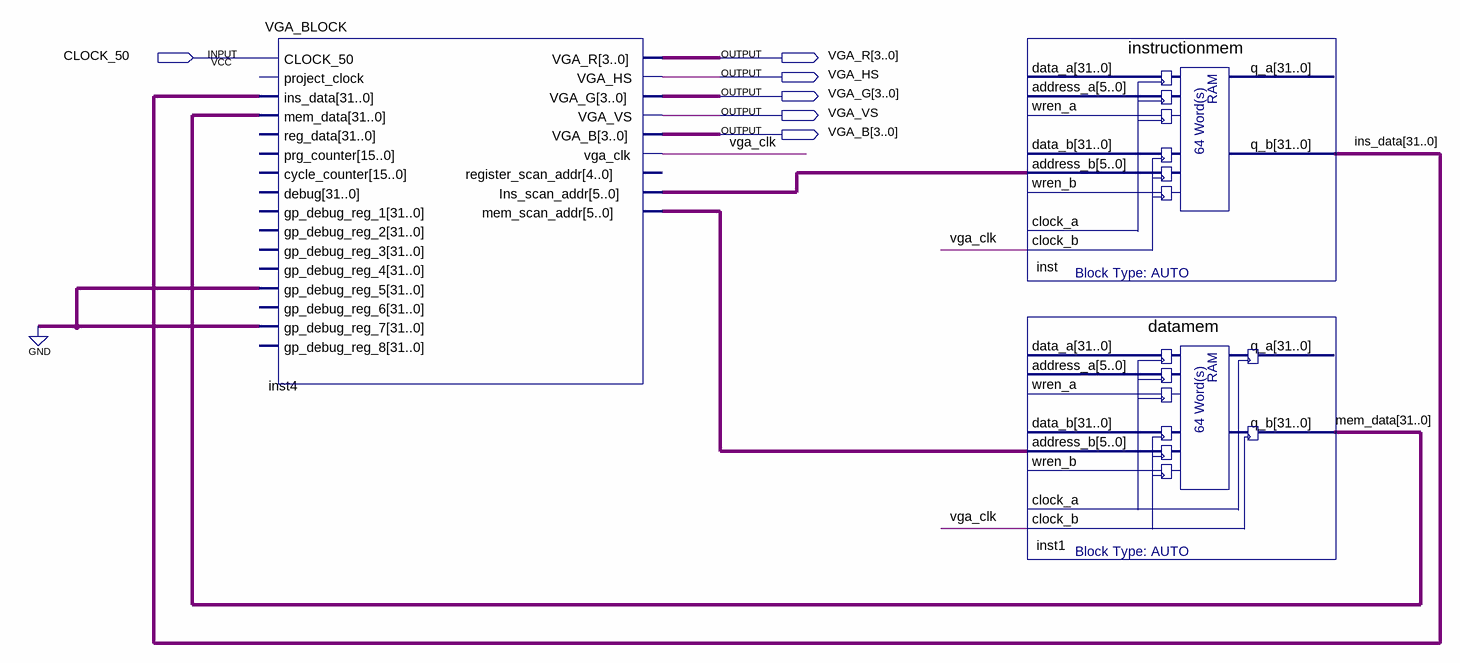
[diagram p0: schematic sheet]
// Quartus schematic VGADEMO.bdf as structural Verilog: 3 symbols, 6 pins
module VGADEMO (
  input  CLOCK_50,
  output [3:0] VGA_R,
  output VGA_HS,
  output [3:0] VGA_G,
  output VGA_VS,
  output [3:0] VGA_B
);

  wire vga_clk;
  wire [5:0] inst4_ins_scan_addr, inst4_mem_scan_addr;
  wire [31:0] ins_data, mem_data;

  VGA_BLOCK inst4 (
    .CLOCK_50(CLOCK_50), .ins_data(ins_data), .mem_data(mem_data), .gp_debug_reg_5({32{1'b0}}),
    .gp_debug_reg_7({32{1'b0}}), .VGA_R(VGA_R), .VGA_HS(VGA_HS), .VGA_G(VGA_G), .VGA_VS(VGA_VS),
    .VGA_B(VGA_B), .vga_clk(vga_clk), .Ins_scan_addr(inst4_ins_scan_addr), .mem_scan_addr(inst4_mem_scan_addr));  // open: project_clock, reg_data, prg_counter, cycle_counter, debug, gp_debug_reg_1, gp_debug_reg_2, gp_debug_reg_3, gp_debug_reg_4, gp_debug_reg_6, gp_debug_reg_8, register_scan_addr
  instructionmem inst (
    .address_b(inst4_ins_scan_addr), .clock_b(vga_clk), .q_b(ins_data));  // open: data_a, address_a, wren_a, data_b, wren_b, clock_a, q_a
  datamem inst1 (
    .address_b(inst4_mem_scan_addr), .clock_b(vga_clk), .q_b(mem_data));  // open: data_a, address_a, wren_a, data_b, wren_b, clock_a, q_a
endmodule
